# EAGLE design ThrustAmpV1 (EAGLE 9.6.2)
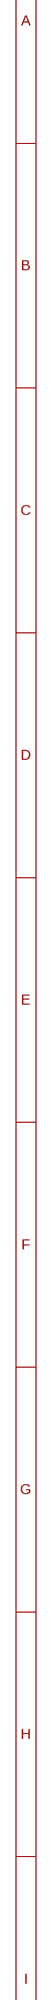
[diagram p0: schematic, sheet 1, part 1 of 2]
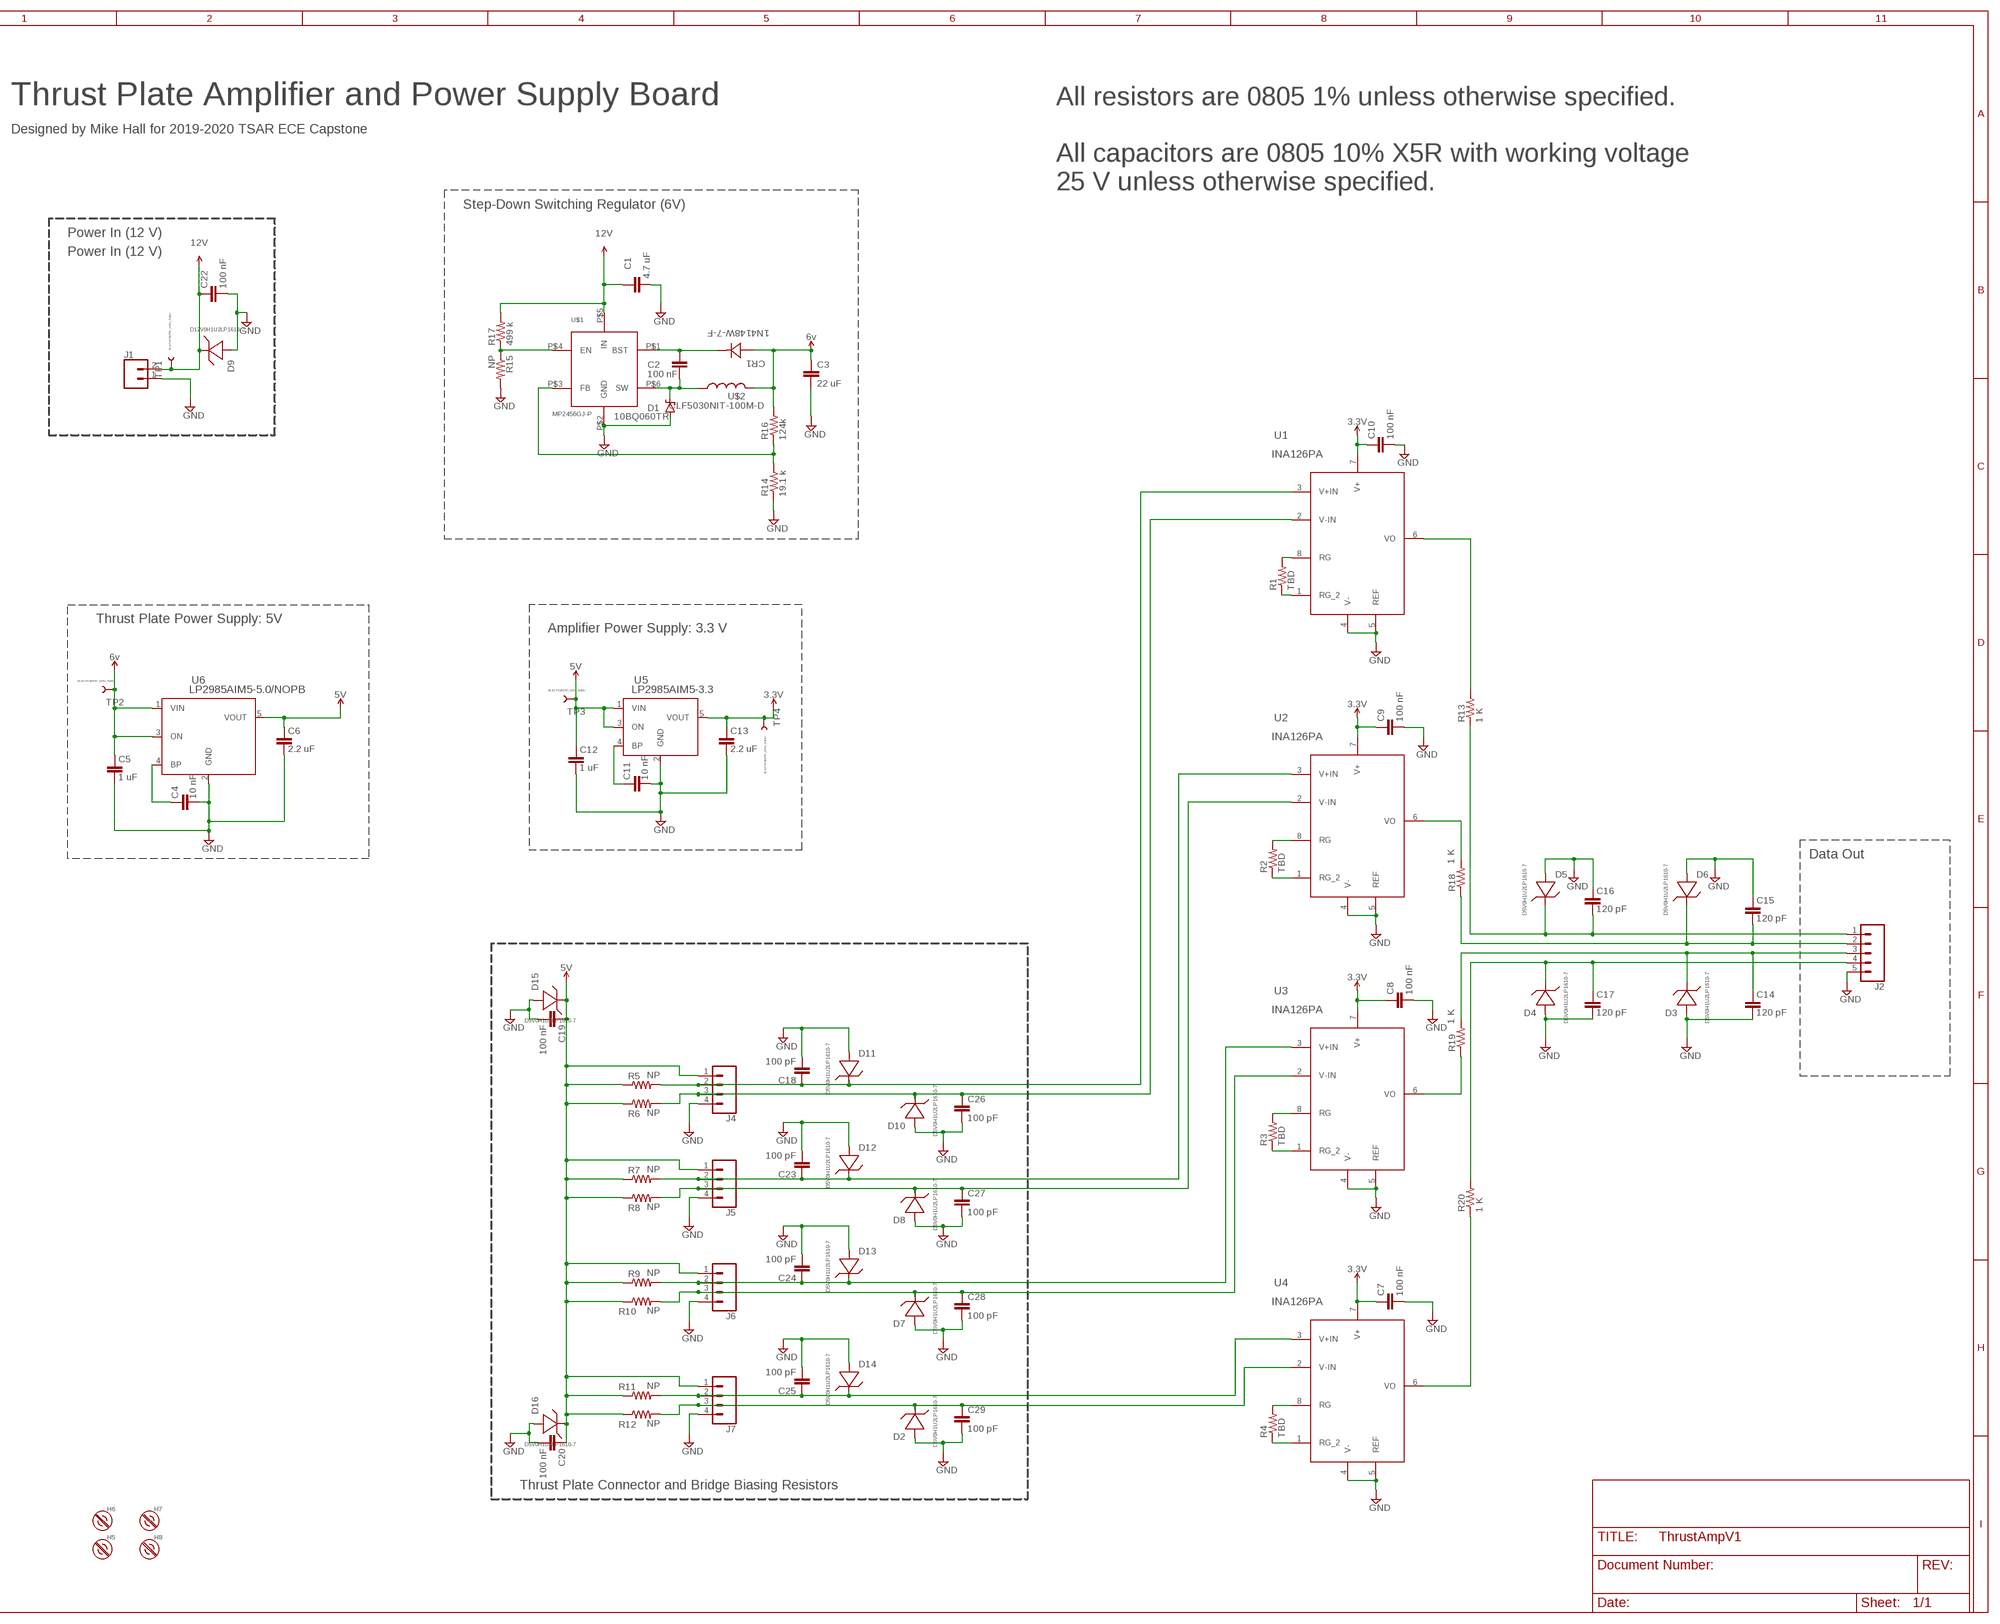
[diagram p1: schematic, sheet 1, part 2 of 2]

## Parts
C1  4.7 uF  C-EUC0805  [C0805]
C2  100 nF  C-EUC0805  [C0805]
C3  22 uF  C-EUC0805  [C0805]
C4  10 nF  C-EUC0805  [C0805]
C5  1 uF  C-EUC0805  [C0805]
C6  2.2 uF  C-EUC0805  [C0805]
C7  100 nF  C-EUC0805K  [C0805K]
C8  100 nF  C-EUC0805K  [C0805K]
C9  100 nF  C-EUC0805K  [C0805K]
C10  100 nF  C-EUC0805K  [C0805K]
C11  10 nF  C-EUC0805  [C0805]
C12  1 uF  C-EUC0805  [C0805]
C13  2.2 uF  C-EUC0805  [C0805]
C14  120 pF  C-EUC0805  [C0805]
C15  120 pF  C-EUC0805  [C0805]
C16  120 pF  C-EUC0805  [C0805]
C17  120 pF  C-EUC0805  [C0805]
C18  100 pF  C-EUC0805K  [C0805K]
C19  100 nF  C-EUC0805K  [C0805K]
C20  100 nF  C-EUC0805K  [C0805K]
C22  100 nF  C-EUC0805K  [C0805K]
C23  100 pF  C-EUC0805K  [C0805K]
C24  100 pF  C-EUC0805K  [C0805K]
C25  100 pF  C-EUC0805K  [C0805K]
C26  100 pF  C-EUC0805K  [C0805K]
C27  100 pF  C-EUC0805K  [C0805K]
C28  100 pF  C-EUC0805K  [C0805K]
C29  100 pF  C-EUC0805K  [C0805K]
CR1  1N4148W-7-F  [SOD123]
D1  10BQ060TR  SCHOTTKY-DIODESMD  [SMB]
D2  D5V0H1U2LP1610-7  [0603DIODE]
D3  D5V0H1U2LP1610-7  [0603DIODE]
D4  D5V0H1U2LP1610-7  [0603DIODE]
D5  D5V0H1U2LP1610-7  [0603DIODE]
D6  D5V0H1U2LP1610-7  [0603DIODE]
D7  D5V0H1U2LP1610-7  [0603DIODE]
D8  D5V0H1U2LP1610-7  [0603DIODE]
D9  D12V0H1U2LP1610-70603DIODE12V  [0603DIODE]
D10  D5V0H1U2LP1610-7  [0603DIODE]
D11  D5V0H1U2LP1610-7  [0603DIODE]
D12  D5V0H1U2LP1610-7  [0603DIODE]
D13  D5V0H1U2LP1610-7  [0603DIODE]
D14  D5V0H1U2LP1610-7  [0603DIODE]
D15  D5V0H1U2LP1610-7  [0603DIODE]
D16  D5V0H1U2LP1610-7  [0603DIODE]
H5  #4-BARE_MOUNTING_HOLE/.300  [#4/.300-BARE+STD_NUT_OR_STAR_WASHER]
H6  #4-BARE_MOUNTING_HOLE/.300  [#4/.300-BARE+STD_NUT_OR_STAR_WASHER]
H7  #4-BARE_MOUNTING_HOLE/.300  [#4/.300-BARE+STD_NUT_OR_STAR_WASHER]
H8  #4-BARE_MOUNTING_HOLE/.300  [#4/.300-BARE+STD_NUT_OR_STAR_WASHER]
J1  CONN_02PTH3  [1X02_LONGPADS]
J2  CONN_05PTH_LONGPADS  [1X05_LONGPADS]
J4  CONN_04  [1X04]
J5  CONN_04  [1X04]
J6  CONN_04  [1X04]
J7  CONN_04  [1X04]
R1  TBD  R-US_R0805  [R0805]
R2  TBD  R-US_R0805  [R0805]
R3  TBD  R-US_R0805  [R0805]
R4  TBD  R-US_R0805  [R0805]
R5  NP  R-US_0207/5V  [0207/5V]
R6  NP  R-US_0207/5V  [0207/5V]
R7  NP  R-US_0207/5V  [0207/5V]
R8  NP  R-US_0207/5V  [0207/5V]
R9  NP  R-US_0207/5V  [0207/5V]
R10  NP  R-US_0207/5V  [0207/5V]
R11  NP  R-US_0207/5V  [0207/5V]
R12  NP  R-US_0207/5V  [0207/5V]
R13  1 K  R-US_R0805  [R0805]
R14  19.1 k  R-US_R0805  [R0805]
R15  NP  R-US_R0805  [R0805]
R16  124k  R-US_R0805  [R0805]
R17  499 k  R-US_R0805  [R0805]
R18  1 K  R-US_R0805  [R0805]
R19  1 K  R-US_R0805  [R0805]
R20  1 K  R-US_R0805  [R0805]
TP1  TEST-POINTTP_15TH_THRU  [TP_15TH]
TP2  TEST-POINTTP_15TH_THRU  [TP_15TH]
TP3  TEST-POINTTP_15TH_THRU  [TP_15TH]
TP4  TEST-POINTTP_15TH_THRU  [TP_15TH]
U1  INA126PA  [P8]
U2  INA126PA  [P8]
U3  INA126PA  [P8]
U4  INA126PA  [P8]
U5  LP2985AIM5-3.3  [MF05A]
U6  LP2985AIM5-5.0/NOPB  [MF05A]
U$1  MP2456GJ-P  [SOT6]
U$2  CLF5030NIT-100M-D  [0.209"LX0.197"W(5.30MMX5.00MM)]

## Nets
3.3V: C7.1 C8.1 C9.1 C10.1 C13.1 TP4.P$1 U1.7(V+) U2.7(V+) U3.7(V+) U4.7(V+) U5.5(VOUT)
5V: C6.1 C12.1 C19.1 C20.1 D15.P$2 D16.P$2 J4.1 J5.1 J6.1 J7.1 R5.1 R6.1 R7.1 R8.1 R9.1 R10.1 R11.1 R12.1 TP3.P$1 U5.1(VIN) U5.3(ON) U6.5(VOUT)
6V: C3.1 C5.1 CR1.2 R16.2 TP2.P$1 U6.1(VIN) U6.3(ON) U$2.2 ; supply symbol labelled 6v
12V: C1.1 C22.1 D9.P$2 J1.2 R17.2 TP1.P$1 U$1.P$5(IN)
GND: C1.2 C3.2 C4.2 C5.2 C6.2 C7.2 C8.2 C9.2 C10.2 C11.2 C12.2 C13.2 C14.2 C15.1 C16.1 C17.2 C18.2 C19.2 C20.2 C22.2 C23.2 C24.2 C25.2 C26.2 C27.2 C28.2 C29.2 D1.A D2.P$1 D3.P$1 D4.P$1 D5.P$1 D6.P$1 D7.P$1 D8.P$1 D9.P$1 D10.P$1 D11.P$1 D12.P$1 D13.P$1 D14.P$1 D15.P$1 D16.P$1 J1.1 J2.5 J4.4 J5.4 J6.4 J7.4 R14.1 R15.2 U1.4(V-) U1.5(REF) U2.4(V-) U2.5(REF) U3.4(V-) U3.5(REF) U4.4(V-) U4.5(REF) U5.2(GND) U6.2(GND) U$1.P$2(GND)
N$1: R1.2 U1.8(RG)
N$2: R1.1 U1.1(RG_2)
N$3: R2.2 U2.8(RG)
N$4: R2.1 U2.1(RG_2)
N$5: R3.2 U3.8(RG)
N$6: R3.1 U3.1(RG_2)
N$7: R4.2 U4.8(RG)
N$8: R4.1 U4.1(RG_2)
N$9: R14.2 R16.1 U$1.P$3(FB)
N$10: C2.1 CR1.1 U$1.P$1(BST)
N$11: R13.2 U1.6(VO)
N$12: R18.2 U2.6(VO)
N$13: R19.1 U3.6(VO)
N$17: R20.1 U4.6(VO)
N$19: C16.2 D5.P$2 J2.1 R13.1
N$20: C15.2 D6.P$2 J2.2 R18.1
N$21: C2.2 D1.C U$1.P$6(SW) U$2.1
N$23: C14.1 D3.P$2 J2.3 R19.2
N$24: C17.1 D4.P$2 J2.4 R20.2
N$25: C11.1 U5.4(BP)
N$26: C4.1 U6.4(BP)
N$28: R15.1 R17.1 U$1.P$4(EN)
N$93: C18.1 D11.P$2 J4.2 R5.2 U1.3(V+IN)
N$94: C26.1 D10.P$2 J4.3 R6.2 U1.2(V-IN)
N$95: C23.1 D12.P$2 J5.2 R7.2 U2.3(V+IN)
N$96: C27.1 D8.P$2 J5.3 R8.2 U2.2(V-IN)
N$97: C24.1 D13.P$2 J6.2 R9.2 U3.3(V+IN)
N$98: C28.1 D7.P$2 J6.3 R10.2 U3.2(V-IN)
N$99: C25.1 D14.P$2 J7.2 R11.2 U4.3(V+IN)
N$100: C29.1 D2.P$2 J7.3 R12.2 U4.2(V-IN)

## Notes on the sheet
- Thrust Plate Amplifier and Power Supply Board
- Designed by Mike Hall for 2019-2020 TSAR ECE Capstone
- All resistors are 0805 1% unless otherwise specified.
  
  All capacitors are 0805 10% X5R with working voltage
  25 V unless otherwise specified.
- Step-Down Switching Regulator (6V)
- Power In (12 V)
- Power In (12 V)
- Thrust Plate Power Supply: 5V
- Amplifier Power Supply: 3.3 V
- Data Out
- Thrust Plate Connector and Bridge Biasing Resistors

## Library data of the parts
C1 = rcl:C-EU: CAPACITOR, European symbol; DIS: Digi-Key; DPN: 1276-1244-1-ND; MFR: Samsung Electro-Mechanics; MPN: CL21A475KAQNNNE; SPICEPREFIX: C
C2 C7-C10 C19 C20 C22 = rcl:C-EU: CAPACITOR, European symbol; DIS: Digi-Key; DPN: 478-12790-1-ND; MFR: AVX Corporation; MPN: 08055D104KAT2A; SPICEPREFIX: C
C3 = rcl:C-EU: CAPACITOR, European symbol; DIS: Digi-Key; DPN: 1276-6786-1-ND; MFR: Samsung Electro-Mechanics; MPN: CL21A226KPCLRNC; SPICEPREFIX: C
C4 C11 = rcl:C-EU: CAPACITOR, European symbol; DIS: Digi-Key; DPN: 445-14445-1-ND; MFR: TDK Corporation; MPN: C2012X5R2E103K125AA; SPICEPREFIX: C
C5 C12 = rcl:C-EU: CAPACITOR, European symbol; DIS: Digi-Key; DPN: 1276-2395-1-ND; MFR: Samsung Electro-Mechanics; MPN: CL21A105KACLNNC; SPICEPREFIX: C
C6 C13 = rcl:C-EU: CAPACITOR, European symbol; DIS: Digi-Key; DPN: 1276-6458-1-ND; MFR: Samsung Electro-Mechanics; MPN: CL21A225KAFNNNG; SPICEPREFIX: C
C14-C17 = rcl:C-EU: CAPACITOR, European symbol; DIS: Digi-Key; DPN: 399-7139-1-ND; MFR: KEMET; MPN: C0805C121KDRACTU; SPICEPREFIX: C
C18 C23-C29 = rcl:C-EU: CAPACITOR, European symbol; DIS: Digi-Key; DPN: 732-8046-1-ND; MFR: Würth Elektronik; MPN: 885012207054; SPICEPREFIX: C
CR1 = TSAR_Controller:1N4148W-7-F; BUILT_BY: EMA_Anthony; COPYRIGHT: Copyright (C) 2016 Accelerated Designs. All rights reserved; DIS: Digi-Key; DPN: 1N4148W-FDICT-ND; MANUFACTURER_PART_NUMBER: 1N4148W-7-F; MFR: Diodes Incorporated; MPN: 1N4148W-7-F; VENDOR: Diodes Inc
D1 = diode:SCHOTTKY-DIODE: Schottky Diode; DIS: Digi-Key; DPN: 1655-1342-1-ND; MFR: SMC Diode Solutions; MPN: 10BQ060TR
D2-D8 D10-D16 = D5V0H1U2LP1610-7:D5V0H1U2LP1610-7; DIS: Digi-Key; DPN: D5V0H1U2LP1610-7DICT-ND; MFR: Diodes Incorporated; MPN: D5V0H1U2LP1610-7
D9 = D5V0H1U2LP1610-7:D12V0H1U2LP1610-7; DIS: Digi-Key; DPN: D12V0H1U2LP1610-7DICT-ND; MFR: Diodes Incorporated; MPN: D12V0H1U2LP1610-7
H5-H8 = mount:#4-BARE_MOUNTING_HOLE: 1/8" drill hole for #4 screw mount
J1 = SparkFun-Connectors:CONN_02: Multi connection point. Often used as Generic Header-pin footprint for 0.1 inch spaced/style header connections On any of the 0.1 inch spaced packages, you can populate with these: Break Away Headers - Straight <https://www.sparkfun.com/products/116> (PRT-00116) Break Away Male Headers - Right Angle <https://www.sparkfun.com/products/553> (PRT-00553) Female Headers <https://www.sparkfun.com/products/115> (PRT-00115) Break Away Headers - Machine Pin <https://www.sparkfun.com/products/117> (PRT-00117) Break Away Female Headers - Swiss Machine Pin <https://www.sparkfun.com/products/743> (PRT-00743) For SCREWTERMINALS and SPRING TERMINALS visit here: Screw Terimnals on SparkFun.com <https://www.sparkfun.com/search/results?term=Screw+Terminals> (5mm/3.5mm/2.54mm spacing) This device is also useful as a general connection point to wire up your design to another part of your project. Our various solder wires solder well into these plated through hole pads. Hook-Up Wire - Assortment (Stranded, 22 AWG) <https://www.sparkfun.com/products/11375> (PRT-11375) Hook-Up Wire - Assortment (Solid Core, 22 AWG) <https://www.sparkfun.com/products/11367> (PRT-11367) View the entire wire category on our website here <https://www.sparkfun.com/categories/141> Special notes: Molex polarized connector foot print use with: PRT-08233 with associated crimp pins and housings. 2.54_SCREWTERM for use with PRT-10571. 3.5mm Screw Terminal footprints for PRT-08084 5mm Screw Terminal footprints for use with PRT-08432; DIS: Digi-Key; DPN: 900-0022232021-ND; MFR: Molex; MPN: 22232021
J2 = SparkFun-Connectors:CONN_05: Multi connection point. Often used as Generic Header-pin footprint for 0.1 inch spaced/style header connections On any of the 0.1 inch spaced packages, you can populate with these: Break Away Headers - Straight <https://www.sparkfun.com/products/116> (PRT-00116) Break Away Male Headers - Right Angle <https://www.sparkfun.com/products/553> (PRT-00553) Female Headers <https://www.sparkfun.com/products/115> (PRT-00115) Break Away Headers - Machine Pin <https://www.sparkfun.com/products/117> (PRT-00117) Break Away Female Headers - Swiss Machine Pin <https://www.sparkfun.com/products/743> (PRT-00743) For SCREWTERMINALS and SPRING TERMINALS visit here: Screw Terimnals on SparkFun.com <https://www.sparkfun.com/search/results?term=Screw+Terminals> (5mm/3.5mm/2.54mm spacing) This device is also useful as a general connection point to wire up your design to another part of your project. Our various solder wires solder well into these plated through hole pads. Hook-Up Wire - Assortment (Stranded, 22 AWG) <https://www.sparkfun.com/products/11375> (PRT-11375) Hook-Up Wire - Assortment (Solid Core, 22 AWG) <https://www.sparkfun.com/products/11367> (PRT-11367) View the entire wire category on our website here <https://www.sparkfun.com/categories/141> Special notes: Molex polarized connector foot print use with SKU : PRT-08231 with associated crimp pins and housings. 1MM SMD Version SKU: PRT-10208; DIS: Digi-Key; DPN: WM4203-ND; MFR: Molex; MPN: 0022232051
J4-J7 = SparkFun-Connectors:CONN_04: Multi connection point. Often used as Generic Header-pin footprint for 0.1 inch spaced/style header connections On any of the 0.1 inch spaced packages, you can populate with these: Break Away Headers - Straight <https://www.sparkfun.com/products/116> (PRT-00116) Break Away Male Headers - Right Angle <https://www.sparkfun.com/products/553> (PRT-00553) Female Headers <https://www.sparkfun.com/products/115> (PRT-00115) Break Away Headers - Machine Pin <https://www.sparkfun.com/products/117> (PRT-00117) Break Away Female Headers - Swiss Machine Pin <https://www.sparkfun.com/products/743> (PRT-00743) For SCREWTERMINALS and SPRING TERMINALS visit here: Screw Terimnals on SparkFun.com <https://www.sparkfun.com/search/results?term=Screw+Terminals> (5mm/3.5mm/2.54mm spacing) This device is also useful as a general connection point to wire up your design to another part of your project. Our various solder wires solder well into these plated through hole pads. Hook-Up Wire - Assortment (Stranded, 22 AWG) <https://www.sparkfun.com/products/11375> (PRT-11375) Hook-Up Wire - Assortment (Solid Core, 22 AWG) <https://www.sparkfun.com/products/11367> (PRT-11367) View the entire wire category on our website here <https://www.sparkfun.com/categories/141> Special notes: Molex polarized connector foot print use with SKU : PRT-08231 with associated crimp pins and housings. 1MM SMD Version SKU: PRT-10208; DIS: Digi-Key; DPN: WM4202-ND; MFR: Molex; MPN: 0022232041; PROD_ID: CONN-09696
R1-R12 R15 = rcl:R-US_: RESISTOR, American symbol; SPICEPREFIX: R
R13 R18-R20 = rcl:R-US_: RESISTOR, American symbol; DIS: Digi-Key; DPN: 311-1.00KCRCT-ND; MFR: Yageo; MPN: RC0805FR-071KL; SPICEPREFIX: R
R14 = rcl:R-US_: RESISTOR, American symbol; DIS: Digi-Key; DPN: RNCP0805FTD19K1CT-ND; MFR: Stackpole Electronics Inc; MPN: RNCP0805FTD19K1; SPICEPREFIX: R
R16 = rcl:R-US_: RESISTOR, American symbol; DIS: Digi-Key; DPN: 2019-RK73H2ATTD1243FCT-ND; MFR: KOA Speer Electronics, Inc.; MPN: RK73H2ATTD1243F; SPICEPREFIX: R
R17 = rcl:R-US_: RESISTOR, American symbol; DIS: Digi-Key; DPN: 2019-RK73H2ATTD4993FCT-ND; MFR: KOA Speer Electronics, Inc.; MPN: RK73H2ATTD4993F; SPICEPREFIX: R
TP1-TP4 = SparkFun-Connectors:TEST-POINT: SparkFun Test Points Bare copper test points for troubleshooting or In-Circuit-Testing. These are used by our Production team for verifying production board runs using pogo-pins on test beds. SparkFun Products: SparkFun LSM9DS1 Breakout <https://www.sparkfun.com/products/13284> SparkFun PSOC <https://www.sparkfun.com/products/13714> SparkFun Load Cell Amplifier <https://www.sparkfun.com/products/13879>
U1-U4 = INA126PA_Instrumentation_amp:INA126PA; BUILT_BY: EMA_UL_Team; DIS: Digi-Key; DPN: INA126PA-ND; MANUFACTURER_PART_NUMBER: INA126PA; MFR: Texas Instruments; MPN: INA126PA; VENDOR: Texas Instruments
U5 = LP2985AIM5-3point3:LP2985AIM5-3.3; BUILT_BY: EMA_UL_Team; DIS: Digi-Key; DPN: LP2985AIM5-3.3/NOPBCT-ND; MANUFACTURER_PART_NUMBER: LP2985AIM5-3.3; MFR: Texas Instruments; MPN: LP2985AIM5-3.3/NOPB; VENDOR: Texas Instruments
U6 = LP2985AIM5-5point0:LP2985AIM5-5.0/NOPB; BUILT_BY: EMA_UL_Team; DIS: Digi-Key; DPN: LP2985AIM5-5.0/NOPBCT-ND; MANUFACTURER_PART_NUMBER: LP2985AIM5-5.0/NOPB; MFR: Texas Instruments; MPN: LP2985AIM5-5.0/NOPB; VENDOR: Texas Instruments
U$1 = TSAR_Controller:MP2456GJ-P; DIS: Digi-Key; DPN: 1589-1120-1-ND; MFR: Monolithic Power Systems Inc.; MPN: MP2456GJ-P
U$2 = TSAR_Controller:CLF5030NIT-100M-D; DIS: Digi-Key; DPN: 445-174699-1-ND; MFR: TDK Corporation; MPN: CLF5030NIT-100M-D

## Board
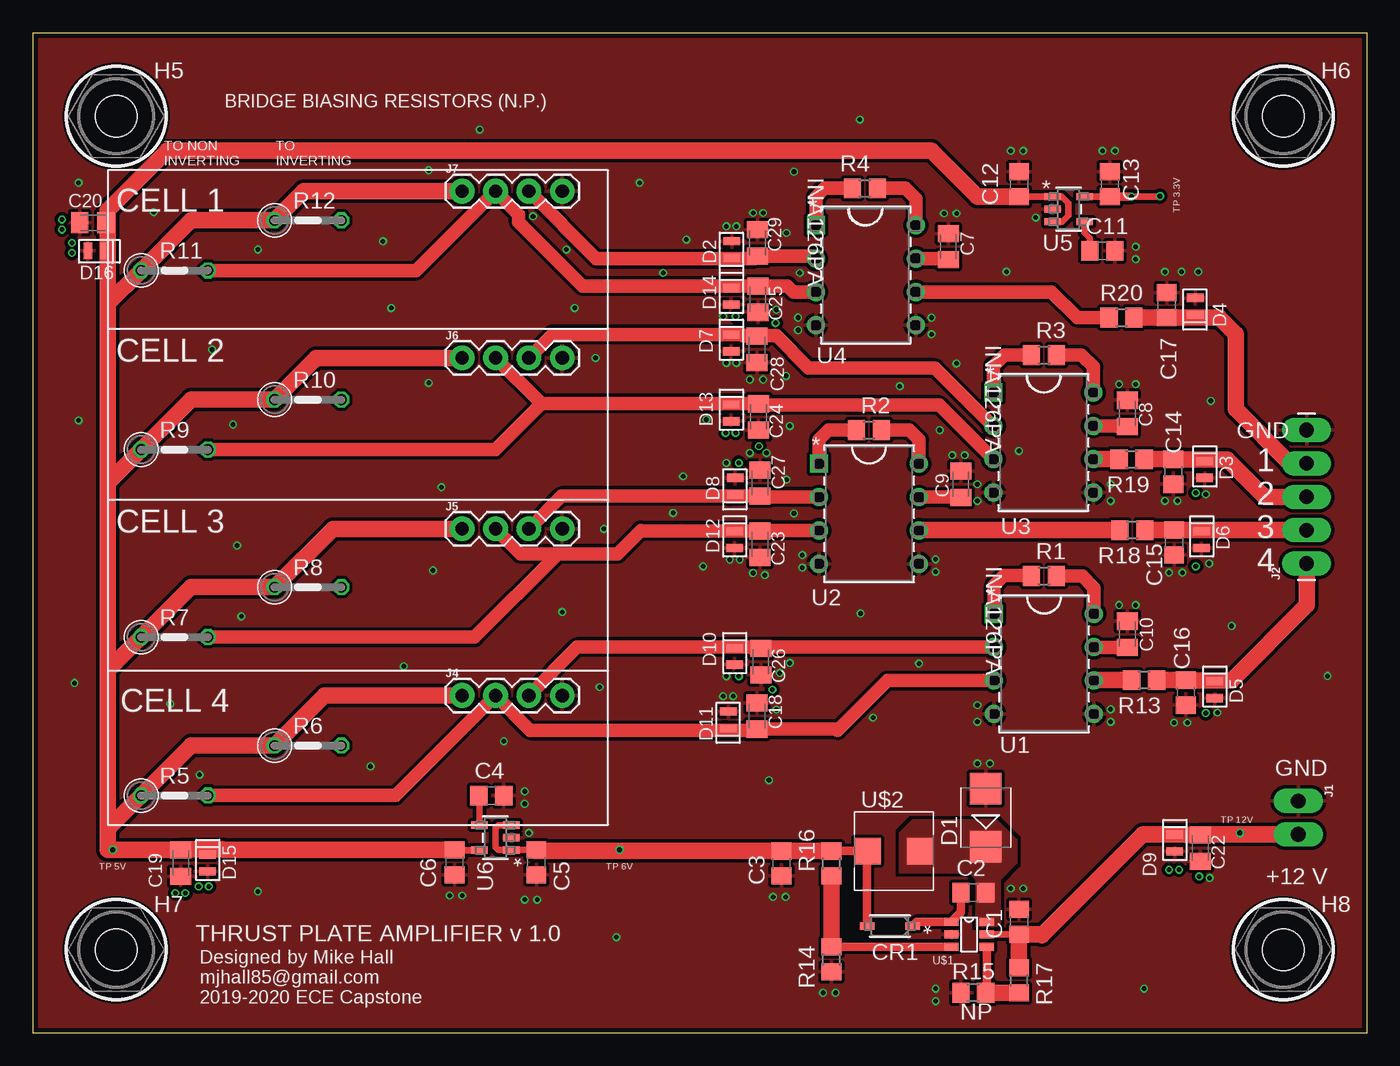
[diagram p2: board, top side]
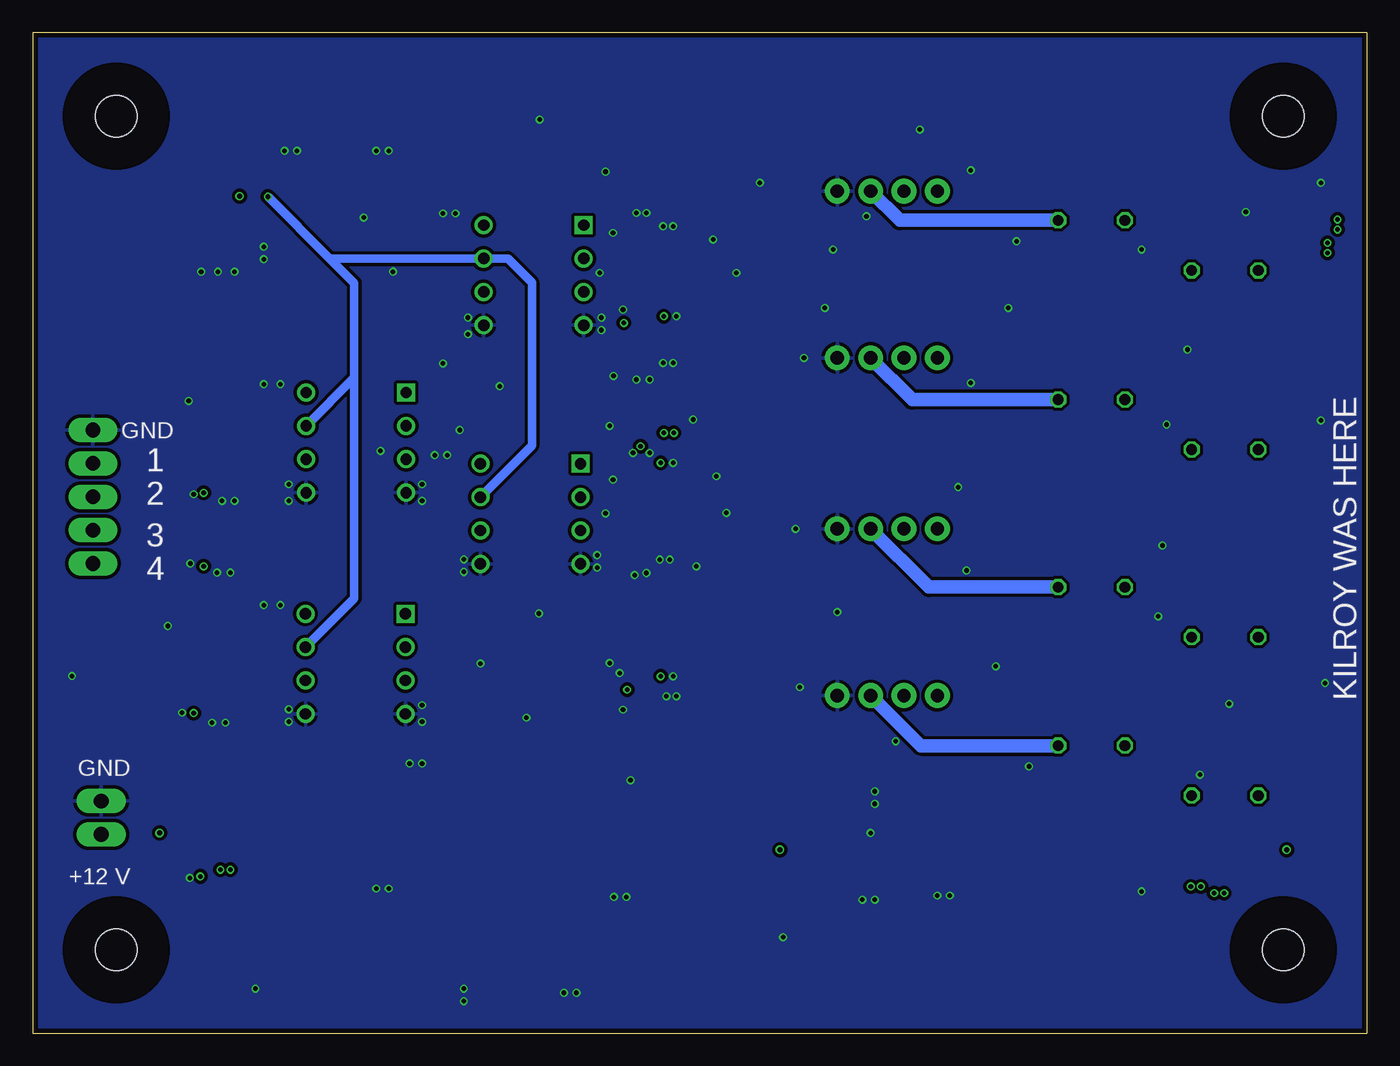
[diagram p3: board, bottom side, seen from below]

Size 101.6 x 76.2 mm. Coordinates in mm from the lower left corner, seen from the top.
Outline: 0,76.2 0,0 101.6,0 101.6,76.2 0,76.2
Copper layers (1*16): Top 0.035559375mm / dielectric 1.6mm / Bottom 0.035559375mm
Design rules "oshpark-2layer": minimum track width 6mil, minimum drill 10mil, track to track 6mil, track to pad 6mil, pad to pad 6mil, via to via 6mil, smd to smd 6mil, copper to edge 15mil, drill to drill 6mil, minimum pad ring 5mil, minimum via ring 5mil, stop-mask expansion 2.5mil, vias tented up to drill 0mil, thermal gap 10mil

### Footprints (pad centres in the part's own frame; a part is rotated, then mirrored left to right if it is on the bottom)
C0805 = smd 1.3 x 1.5: 1 -0.95,0; 2 0.95,0
C0805K = smd 1.3 x 1.6: 1 -1,0; 2 1,0
SOD123 = smd 1.111 x 0.601: 1 -1.725,0; 2 1.725,0
SMB = smd 2.4 x 2.4: A 2.2,0; C -2.2,0
0603DIODE = smd 0.635 x 1.27: P$1 -0.635,-0.102; P$2 0.635,-0.102
#4/.300-BARE+STD_NUT_OR_STAR_WASHER = hole 3.175: 0,0
1X02_LONGPADS = drill 1.118 pad 1.88 long: 1 0,0; 2 2.54,0
1X05_LONGPADS = drill 1.118 pad 1.88 long: 1 0,0; 2 2.54,0; 3 5.08,0; 4 7.62,0; 5 10.16,0
1X04 = drill 1.016 pad 1.88: 1 0,0; 2 2.54,0; 3 5.08,0; 4 7.62,0
R0805 = smd 1.3 x 1.5: 1 -0.95,0; 2 0.95,0
0207/5V = drill 0.813 octagon: 1 -2.54,0; 2 2.54,0
TP_15TH = drill 0.381 pad 0.61: P$1 0,0
P8 = drill 0.864 pad 1.372 square: 1 -3.81,3.81 | drill 0.864 pad 1.372: 2 -3.81,1.27; 3 -3.81,-1.27; 4 -3.81,-3.81; 5 3.81,-3.81; 6 3.81,-1.27; 7 3.81,1.27; 8 3.81,3.81
MF05A = smd 1.27 x 0.559: 1 -1.219,0.953; 2 -1.219,0; 3 -1.219,-0.953; 4 1.219,-0.953; 5 1.219,0.953
SOT6 = smd 1.092 x 0.61: P$1 -1.346,0.95; P$2 -1.346,0; P$3 -1.346,-0.95; P$4 1.346,-0.95; P$5 1.346,0; P$6 1.346,0.95
0.209"LX0.197"W(5.30MMX5.00MM) = smd 2 x 2: 1 -2,0; 2 2,0

### Placement (x,y rotation side)
C1  75.12,8.47 90 top
C2  71.63,10.69 0 top
C3  57.02,12.92 270 top
C4  34.92,18.1 0 top
C5  38.35,13.02 270 top
C6  32.13,13.02 270 top
C7  69.72,59.91 90 top
C8  83.38,47.21 90 top
C9  70.68,41.81 90 top
C10  83.38,30.38 90 top
C11  81.47,59.59 0 top
C12  75.12,64.67 90 top
C13  82.04,64.67 90 top
C14  86.87,42.76 270 top
C15  86.93,37.36 90 top
C16  87.82,25.93 90 top
C17  86.36,55.46 90 top
C18  55.17,24.16 90 top
C19  11.28,12.95 270 top
C20  4.57,61.72 180 top
C22  88.93,14.1 270 top
C23  55.4,37.24 270 top
C24  55.27,46.94 270 top
C25  55.22,55.91 270 top
C26  55.45,28.3 270 top
C27  55.4,41.91 90 top
C28  55.17,52.1 270 top
C29  55.19,60.2 90 top
CR1  65.28,8.15 180 top
D1  72.58,16.41 90 top
D2  53.34,59.69 270 top
D3  89.15,42.93 90 top
D4  88.65,55.37 270 top
D5  89.92,26.16 90 top
D6  88.9,37.59 90 top
D7  53.09,52.58 90 top
D8  53.59,41.66 270 top
D9  86.87,14.48 90 top
D10  53.34,28.7 90 top
D11  53.09,23.88 270 top
D12  53.34,37.59 90 top
D13  53.09,47.24 90 top
D14  53.09,56.13 90 top
D15  13.21,12.95 90 top
D16  4.83,59.69 0 top
H5  6.35,69.85 0 top
H6  95.25,69.85 0 top
H7  6.35,6.35 0 top
H8  95.25,6.35 0 top
J1  96.39,17.68 270 top
J2  97.03,35.78 90 top
J4  32.7,25.72 0 top
J5  32.7,38.42 0 top
J6  32.7,51.44 0 top
J7  32.7,64.14 0 top
R1  77.03,34.82 0 top
R2  63.69,45.94 0 top
R3  77.03,51.65 0 top
R4  63.37,64.35 0 top
R5  10.79,18.1 0 top
R6  20.95,21.91 0 top
R7  10.79,30.16 0 top
R8  20.95,33.97 0 top
R9  10.79,44.45 0 top
R10  20.95,48.26 0 top
R11  10.79,58.1 0 top
R12  20.95,61.91 0 top
R13  84.65,26.89 180 top
R14  60.83,5.61 90 top
R15  71.63,3.07 180 top
R16  60.83,12.92 90 top
R17  75.12,4.03 90 top
R18  83.76,38.32 180 top
R19  83.69,43.71 0 top
R20  82.93,54.51 0 top
TP1  91.95,15.24 0 top
TP2  44.7,13.97 0 top
TP3  6.1,13.97 0 top
TP4  85.85,63.75 0 top
U1  77.03,28.13 0 top
U2  63.69,39.56 0 top
U3  76.97,44.98 0 top
U4  63.45,57.73 0 top
U5  78.89,62.76 0 top
U6  35.23,14.88 180 top
U$1  71.31,7.52 0 top
U$2  65.6,13.87 180 top

### Tracks (layer width: path | path; a pad name or v marks a point on that pad's centre or on a via)
3.3V  (via drill 0.35)
  Top 0.152: TP4.P$1 85.81,63.72
  Top 0.508: C13.1 U5.5 | v83.69,63.72 85.81,63.72
  Top 0.635: C13.1 v83.69,63.72
  Top 1.016: U4.7 69.62,59 C7.1 | U3.7 83.33,46.25 C8.1 | U2.7 70.65,40.83 C9.1 | C10.1 80.86,29.38 U1.7
  Bottom 0.635: v83.69,63.72 78.98,59 | 78.98,59 U4.7 65.41,59 63.58,57.17 63.58,44.76 U2.7 | 78.98,59 77.11,57.14 77.11,49.92 | 77.11,49.92 U3.7 | 77.11,49.92 77.11,33.12 U1.7
5V
  Top 0.152: 13.21,14.01 13.23,13.99 13.23,13.67 D15.P$2 | TP3.P$1 5.71,13.97 | D16.P$2 5.71,59.59
  Top 0.508: C12.1 U5.1 78.37,63.72 78.87,63.22 78.87,62.26 78.42,61.81 U5.3 | U6.5 32.17,13.93 C6.1
  Top 1.27: J4.1 22.23,25.72 R6.1 12.06,21.91 R5.1 5.91,15.75 5.71,15.75 | 5.71,15.75 5.71,13.97 5.73,13.95 C19.1 11.33,14.01 13.21,14.01 14.49,14.01 14.53,13.97 C6.1 | 5.71,15.75 5.71,27.62 | 5.71,27.62 5.71,41.91 | 5.71,41.91 5.71,55.56 | 5.71,61.72 5.71,62.67 10.25,67.21 68.45,67.21 71.94,63.72 C12.1 | J5.1 22.86,38.42 R8.1 12.06,33.97 R7.1 5.71,27.62 | J6.1 21.59,51.44 R10.1 12.06,48.26 R9.1 5.71,41.91 | J7.1 20.64,64.14 R12.1 12.06,61.91 R11.1 5.71,55.56 | 5.71,61.72 5.71,59.59 5.71,55.56 | C20.1 5.71,61.72
6V
  Top 0.152: 38.22,13.87 38.12,13.97 | TP2.P$1 44.6,13.87 44.2,13.87
  Top 0.508: 38.12,13.97 C5.1 | U6.1 36.46,13.95 | 38.12,13.97 36.48,13.97 36.46,13.95 | U6.3 35.42,15.84 35.23,15.65 35.23,14.15 35.43,13.95 36.46,13.95
  Top 0.635: R16.2 U$2.2 63.55,13.83 CR1.2
  Top 1.27: R16.2 C3.1 44.2,13.87 38.22,13.87
12V
  Top 0.152: TP1.P$1 92.35,15.24 92.46,15.14 | D9.P$2 86.9,15.11 86.87,15.15
  Top 0.508: C1.1 U$1.P$5
  Top 1.27: R17.2 C1.1 76.77,7.52 76.85,7.45 84.55,15.15 86.87,15.15 87.79,15.15 87.84,15.1 C22.1 88.97,15.14 92.46,15.14 J1.2
GND  (via drill 0.35)
  other vias: 71.95,23.71 58.29,53.56 58.29,54.51 68.45,53.24 68.45,54.51 69.41,62.45 70.36,62.45 74.49,67.21 75.44,67.21 76.39,62.13 84.01,59.91 84.01,58.95 81.47,67.21 82.42,67.21 86.23,58 87.5,58 88.77,58 84.01,49.43 82.74,49.43 70.04,44.03 70.99,44.03 71.95,41.81 71.95,40.54 82.11,40.54 82.11,41.81 87.19,40.54 86.23,40.54 89.34,41.05 89.6,35.78 87.57,35.08 86.55,35.08 84.01,32.6 82.74,32.6 82.11,23.71 82.11,24.66 86.93,23.65 87.95,23.65 90.23,24.41 71.95,24.98 72.9,20.54 71.95,20.54 68.77,35.14 68.77,36.09 58.61,35.46 58.61,36.41 31.75,10.48 32.7,10.48 37.47,10.16 37.78,15.24 38.42,10.16 37.47,17.46 37.47,18.41 56.39,10.38 57.34,10.38 60.2,3.07 61.15,3.07 74.49,11.01 75.44,11.01 68.77,3.39 68.77,2.44 38.1,62.23 40.64,59.69 41.27,55.24 42.86,51.44 57.37,50.06 69.09,45.94 70.36,51.02 57.66,46.25 57.98,39.59 43.5,38.42 63.06,31.97 40.32,32.07 67.5,28.16 43.18,26.35 35.88,22.23 64.01,24.03 25.72,20.32 30.48,35.24 15.88,31.75 12.7,19.68 10.48,25.08 28.26,27.94 31.11,41.59 15.56,37.15 30.16,49.53 15.24,46.35 27.3,55.24 13.65,52.07 17.14,59.69 26.67,60.33 9.21,62.55 30.16,65.72 57.98,65.62 3.49,64.77 3.49,46.67 3.17,26.67 17.14,10.79 56.07,19.27 44.45,7.3 84.65,3.39 89.64,11.82 98.62,27.2 89.73,48.16 91.31,31.01 55.75,34.89 74.17,58 75.12,44.35 34.04,68.83 57.4,60.96 55.63,62.48 53.59,61.47 52.83,61.47 49.78,60.45 54.86,62.48 46.23,64.77 58.42,57.91 48.01,57.91 52.58,54.61 56.64,55.12 55.63,49.78 54.61,49.78 52.83,51.05 53.59,51.05 55.88,44.2 54.61,44.2 52.83,43.43 48.77,39.62 51.31,46.74 49.53,42.42 57.4,42.16 51.05,35.56 53.09,36.07 53.85,36.07 54.86,35.05 52.83,27.18 66.04,49.28 56.64,24.64 57.66,28.19 56.9,27.43 53.34,25.65 52.58,25.65 62.99,69.6
  pour Top (isolate 0.254, rank 6): 0,0 0,76.2 101.6,76.2 101.6,0
  pour Bottom (isolate 0.254, rank 6): 0,76.2 0,0 101.6,0 101.6,76.2
GND1  (via drill 0.35)
  other vias: 2.98,59.44
GND2  (via drill 0.35)
  other vias: 2.22,61.98
GND3  (via drill 0.35)
  other vias: 2.22,61.21
GND4  (via drill 0.35)
  other vias: 2.98,60.2
GND5  (via drill 0.35)
  other vias: 13.4,11.18
GND6  (via drill 0.35)
  other vias: 12.64,11.18
GND7  (via drill 0.35)
  other vias: 11.62,10.67
GND8  (via drill 0.35)
  other vias: 10.86,10.67
GND9  (via drill 0.35)
  other vias: 88.58,41.15
GND10  (via drill 0.35)
  other vias: 88.58,35.56
GND11  (via drill 0.35)
  other vias: 89.34,24.38
GND12  (via drill 0.35)
  other vias: 88.84,11.94
GND13  (via drill 0.35)
  other vias: 87.31,12.45
GND14  (via drill 0.35)
  other vias: 86.55,12.45
GND15  (via drill 0.35)
  other vias: 53.78,27.18
GND16  (via drill 0.35)
  other vias: 56.32,26.16
GND17  (via drill 0.35)
  other vias: 53.78,43.43
GND18  (via drill 0.35)
  other vias: 55.31,44.7
GND19  (via drill 0.35)
  other vias: 53.53,45.72
GND20  (via drill 0.35)
  other vias: 52.77,45.72
GND21  (via drill 0.35)
  other vias: 53.53,54.61
GND22  (via drill 0.35)
  other vias: 56.58,54.1
N$1
  Top 1.016: U1.8 80.83,33.92 79.93,34.82 R1.2
N$2
  Top 1.016: U1.1 73.22,34.1 73.97,34.85 76.05,34.85 R1.1
N$3
  Top 1.016: U2.8 67.5,45.2 66.76,45.94 R2.2
N$4
  Top 1.016: U2.1 59.88,45.23 60.6,45.95 62.73,45.95 R2.1
N$5
  Top 1.016: U3.8 80.78,50.76 79.88,51.66 77.99,51.66 R3.2
N$6
  Top 1.016: U3.1 73.17,50.81 74,51.65 R3.1
N$7
  Top 1.016: U4.8 67.26,63.58 66.47,64.36 64.34,64.36 R4.2
N$8
  Top 1.016: U4.1 59.64,63.68 60.31,64.35 R4.1
N$9
  Top 0.635: U$1.P$3 R14.2
  Top 1.27: R16.1 R14.2
N$10
  Top 0.635: CR1.1 67.32,8.47 U$1.P$1 70.68,9.18 C2.1
N$11
  Top 1.27: R13.2 80.94,26.89 U1.6
N$12
  Top 1.27: R18.2 67.58,38.32 U2.6
N$13
  Top 1.27: R19.1 U3.6
N$17
  Top 1.016: U4.6 77.6,56.46 79.55,54.51 R20.1
N$19
  Top 0.152: C16.2 | D5.P$2 90.1,26.88 90.42,26.88
  Top 1.27: C16.2 R13.1 | C16.2 90.42,26.88 91.31,26.88 97.03,32.6 J2.1
N$20
  Top 0.152: C15.2 | R18.1 | D6.P$2 89.32,38.23 89.41,38.32
  Top 1.27: J2.2 89.41,38.32 C15.2 | C15.2 R18.1
N$21
  pour Top (no thermals): 73.41,8.13 71.88,8.13 71.88,11.68 71.37,12.19 66.04,12.19 66.04,15.24 67.06,16.26 73.41,16.26 74.93,14.73 74.93,12.95 73.66,11.68 73.66,8.38
N$23
  Top 0.152: D3.P$2 89.41,43.71
  Top 1.27: R19.2 C14.1 89.41,43.71 91,43.71 93.85,40.86 J2.3
N$24
  Top 0.152: D4.P$2 88.77,54.51 89.41,54.51
  Top 1.27: J2.4 95.76,43.4 91.63,47.52 91.63,53.24 90.36,54.51 89.41,54.51 C17.1 R20.2
N$25
  Top 0.508: C11.1 80.52,60.58 80.11,60.98 U5.4
N$26
  Top 0.508: U6.4 34.01,18.06 C4.1
N$28
  Top 0.635: U$1.P$4 72.66,4.1 R15.1
  Top 1.27: R17.1 R15.1
N$93
  Top 0.152: 52.58,23.08 52.64,23.08 52.7,23.09 D11.P$2
  Top 1.016: R5.2 27.62,18.1 J4.2 37.88,23.08 52.58,23.08 52.83,23.08 55.25,23.08 C18.1 61.22,23.16 61.3,23.08 65.09,26.86 U1.3
N$94
  Top 0.152: D10.P$2 52.92,29.34 52.86,29.4
  Top 1.016: U1.2 55.55,29.4 C26.1 54.87,29.3 54.77,29.4 52.86,29.4 41.47,29.4 J4.3
  Bottom 1.016: R6.2 23.51,21.89 33.96,21.89 J4.3
N$95
  Top 0.152: D12.P$2 53.09,38.23 53.09,38.24
  Top 1.016: 40.01,36.51 37.15,36.51 J5.2 | R7.2 33.66,30.16 40.01,36.51 | 40.01,36.51 44.54,36.51 46.32,38.29 46.37,38.24 53.09,38.24 C23.1 55.45,38.29 U2.3
N$96
  Top 0.152: 53.09,40.91 53.2,41.02 D8.P$2
  Top 1.016: U2.2 55.48,40.83 C27.1 53.09,40.91 40.27,40.91 J5.3
  Bottom 1.016: R8.2 33.34,33.97 J5.3
N$97
  Top 0.152: D13.P$2 52.89,47.88 52.83,47.94
  Top 1.016: U3.3 69.04,47.84 55.37,47.84 C24.1 52.83,47.94 38.74,47.94 38.73,47.94 | J6.2 38.73,47.94 | R9.2 35.24,44.45 38.73,47.94
N$98
  Top 0.152: D7.P$2 52.59,53.21 52.58,53.22
  Top 1.016: J6.3 39.57,53.22 52.58,53.22 54.01,53.22 54.14,53.09 C28.1 55.19,53.12 56.63,53.12 59.09,50.66 68.73,50.66 73.13,46.25 U3.2
  Bottom 1.016: R10.2 34.61,48.26 J6.3
N$99
  Top 0.152: 52.83,56.91 52.83,56.9 52.96,56.77 D14.P$2
  Top 1.016: R11.2 29.21,58.1 J7.2 37.01,62.37 37.01,61.78 41.88,56.91 52.83,56.91 54.03,56.91 54.04,56.91 C25.1 57.5,56.91 57.94,56.46 U4.3
N$100
  Top 0.152: D2.P$2 52.88,59.05 52.83,59
  Top 1.016: J7.3 42.91,59 52.83,59 55,59 C29.1 59.45,59.2 U4.2
  Bottom 1.016: R12.2 35.56,61.91 J7.3

### Text on the board
tPlace: BRIDGE BIASING RESISTORS (N.P.) | TO NON / INVERTING | TO / INVERTING | CELL 1 | TP 3.3V | CELL 2 | GND | 1 | 2 | CELL 3 | 3 | 4 | CELL 4 | GND | TP 12V | TP 5V | TP 6V | +12 V | THRUST PLATE AMPLIFIER v 1.0 | Designed by Mike Hall / mjhall85@gmail.com / 2019-2020 ECE Capstone | NP
bPlace: KILROY WAS HERE | GND | 1 | 2 | 3 | 4 | GND | +12 V